# Altium schematic sheet SeriesParallel.SchDoc
size A4
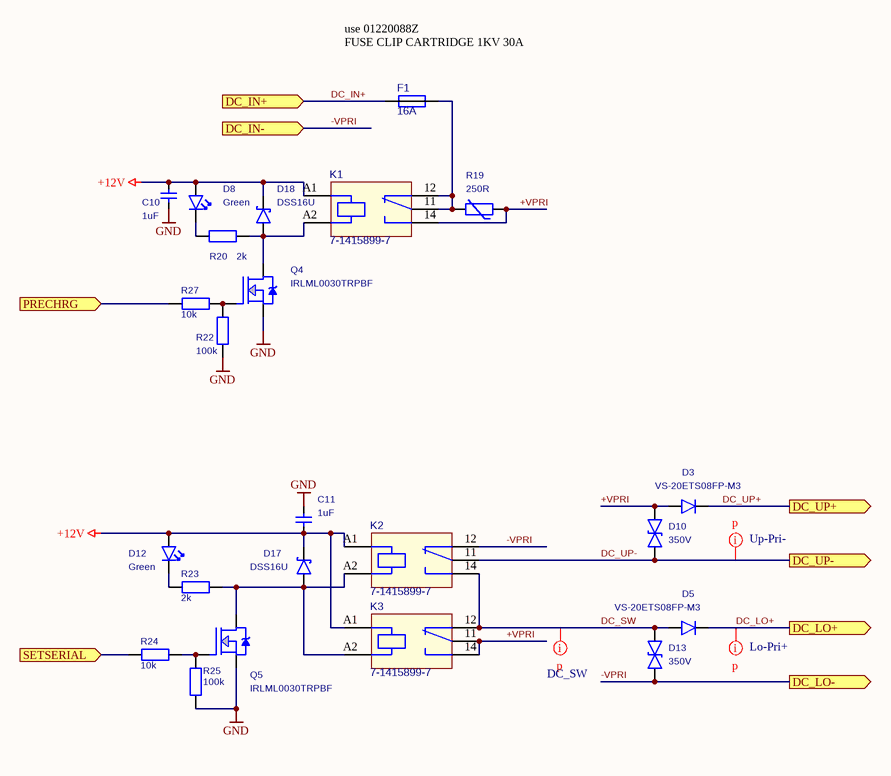
[diagram p0: SeriesParallel.SchDoc]

## Parts
C10  1uF  [C-0805]
C11  1uF  [C-0805]
D3  VS-20ETS08FP-M3  [TO-220FP]
D5  VS-20ETS08FP-M3  [TO-220FP]
D8  Green  [LED-0603_GREEN]
D10  350V  [DO-214AB(SMC)]
D12  Green  [LED-0603_GREEN]
D13  350V  [DO-214AB(SMC)]
D17  DSS16U  [SOD-123]
D18  DSS16U  [SOD-123]
F1  16A  [FC-101-22]
K1  7-1415899-7  [RT2]
K2  7-1415899-7  [RT2]
K3  7-1415899-7  [RT2]
Q4  IRLML0030TRPBF  [SOT-23]
Q5  IRLML0030TRPBF  [SOT-23]
R19  250R  [PTCEL17]
R20  2k  [R-0603]
R22  100k  [R-0603]
R23  2k  [R-0603]
R24  10k  [R-0603]
R25  100k  [R-0603]
R27  10k  [R-0603]

## Ports
DC_IN+ (in), DC_IN- (in), DC_LO+ (out), DC_LO- (out), DC_UP+ (out), DC_UP- (out), PRECHRG (in), SETSERIAL (in)

## Nets
+12V: C10.1 C11.1 D8.A D12.A D17.K D18.K K1.A1 K2.A1 K3.A1
GND: C10.2 C11.2 Q4.2(SOURCE) Q5.2(SOURCE) R22.2 R25.1
+VPRI: D3.A D10.K K1.14 K3.11 K3.14 R19.1
-VPRI: D13.A K2.12 ; port DC_IN-, port DC_LO-
DC_IN+: F1.2 ; port DC_IN+
DC_LO+: D5.K ; port DC_LO+
DC_SW: D5.A D13.K K2.14 K3.12
DC_UP+: D3.K ; port DC_UP+
DC_UP-: D10.A K2.11 ; port DC_UP-
PRECHRG: R27.1 ; port PRECHRG
SETSERIAL: R24.1 ; port SETSERIAL
NetD8_K: D8.K R20.2
NetD12_K: D12.K R23.2
NetD17_A: D17.A K2.A2 K3.A2 Q5.3(DRAIN) R23.1
NetD18_A: D18.A K1.A2 Q4.3(DRAIN) R20.1
NetF1_1: F1.1 K1.11 K1.12 R19.2
NetQ4_1: Q4.1(GATE) R22.1 R27.2
NetQ5_1: Q5.1(GATE) R24.2 R25.2

## Layout directives
net class Lo-Pri+: DC_LO+
net class Up-Pri-: DC_UP-
net class DC_SW: DC_SW

## Notes on the sheet
- (near F1) use 01220088Z
  FUSE CLIP CARTRIDGE 1KV 30A

## Library data of the parts
C10 C11 = C: X7R 16V; Manufacturer: Generic; Supplier 1: Digi-Key
D3 D5 = DIODE: DIODE GEN PURP 800V 20A TO220FP; Manufacturer: Vishay; WEB: *; Manufacturer Part Number: VS-20ETS08FP-M3; Supplier 1: Digi-Key; Supplier Part Number 1: VS-20ETS08FP-M3GI-ND
D8 D12 = DIOD LED: LED GREEN CLEAR 0603 SMD; Manufacturer Part Number: 150060GS75000; Manufacturer: Würth Elektronik; WEB: https://www.digikey.com/product-detail/en/wurth-electronics-inc/150060GS75000/732-4971-1-ND/4489896; Supplier 1: Digi-Key; Supplier Part Number 1: 732-4971-1-ND
D10 D13 = DIODE TVS Bi: SIDACTOR 350V 3000A DO214AB; Manufacturer: Littelfuse Inc.; Manufacturer Part Number: P3800S3NLRP; Supplier Part Number 1: 18-P3800S3NLRPCT-ND; Supplier 1: Digi-Key; WEB: *
D17 D18 = DIODE SHOTKI: SCHOTTKY 60V SOD-123FL; Manufacturer: SMC Diode Solutions; Supplier Part Number 1: 1655-DSS16UCT-ND; Supplier 1: Digi-Key; WEB: *; Manufacturer Part Number: DSS16U
F1 = FUSE BRD: FUSE 16A 600VDC; Manufacturer: Littelfuse Inc.; Manufacturer Part Number: 0506016.MXP; Supplier 1: Digikey; Supplier Part Number 1: F1688-ND
K1-K3 = RZ: RELAY SPDT 16A 12V; Manufacturer: TE Connectivity; Supplier 1: Digi-Key; Supplier Part Number 1: PB2016-ND; Manufacturer Part Number: 7-1415899-7
Q4 Q5 = MOSF-N: MOSFET N-CH 30V 5.3A SOT23; Manufacturer: Infineon Technologies; WEB: *; Supplier 1: Digi-Key; Supplier Part Number 1: IRLML0030TRPBFCT-ND; Manufacturer Part Number: IRLML0030TRPBF
R19 = R_TERMO: PTC EL LDD 16D5 250R 860 135 B E; Manufacturer Part Number: PTCEL17R251SBE; Manufacturer: Vishay; Supplier 1: Digi-Key; Supplier Part Number 1: 56-PTCEL17R251SBE-ND
R20 R22-R25 R27 = R: Resistor; Manufacturer: Generic; Supplier 1: Digi-Key